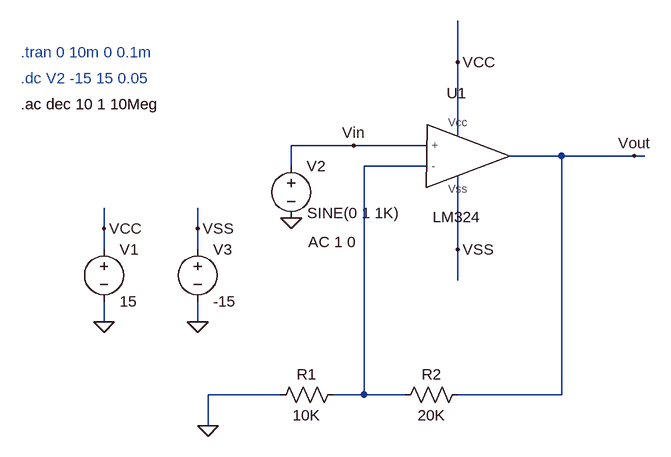
[diagram p0: schematic BAI 1 CHUAN BI & THUC HANH.asc]
BAI 1 CHUAN BI & THUC HANH.asc, the LTspice schematic file:
Version 4.1
SHEET 1 880 680
WIRE 512 -144 512 -208
WIRE 512 -32 512 -144
WIRE 352 -16 256 -16
WIRE 464 -16 352 -16
WIRE 672 0 592 0
WIRE 784 0 672 0
WIRE 800 0 784 0
WIRE 256 16 256 -16
WIRE 464 16 368 16
WIRE -32 112 -32 80
WIRE 112 112 112 80
WIRE -32 144 -32 112
WIRE 112 144 112 112
WIRE 512 144 512 32
WIRE 512 192 512 144
WIRE -32 256 -32 224
WIRE 112 256 112 224
WIRE 240 368 128 368
WIRE 368 368 368 16
WIRE 368 368 320 368
WIRE 432 368 368 368
WIRE 672 368 672 0
WIRE 672 368 512 368
WIRE 128 416 128 368
FLAG -32 256 0
FLAG -32 112 VCC
FLAG 112 256 0
FLAG 112 112 VSS
FLAG 512 -144 VCC
FLAG 512 144 VSS
FLAG 784 0 Vout
FLAG 128 416 0
FLAG 352 -16 Vin
FLAG 256 96 0
SYMBOL voltage -32 128 R0
SYMATTR InstName V1
SYMATTR Value 15
SYMBOL voltage 112 128 R0
SYMATTR InstName V3
SYMATTR Value -15
SYMBOL LM324 512 0 R0
SYMATTR InstName U1
SYMBOL res 528 352 R90
WINDOW 0 0 56 VBottom 2
WINDOW 3 32 56 VTop 2
SYMATTR InstName R2
SYMATTR Value 20K
SYMBOL res 336 352 R90
WINDOW 0 0 56 VBottom 2
WINDOW 3 32 56 VTop 2
SYMATTR InstName R1
SYMATTR Value 10K
SYMBOL voltage 256 0 R0
WINDOW 3 25 88 Left 2
WINDOW 123 26 133 Left 2
WINDOW 39 0 0 Left 0
SYMATTR Value SINE(0 1 1K)
SYMATTR Value2 AC 1 0
SYMATTR InstName V2
TEXT -160 -160 Left 2 ;.tran 0 10m 0 0.1m
TEXT -160 -120 Left 2 ;.dc V2 -15 15 0.05
TEXT -160 -80 Left 2 !.ac dec 10 1 10Meg

The netlist it stands for:
* BAI 1 CHUAN BI & THUC HANH.asc
V1 VCC 0 15
V3 VSS 0 -15
X§U1 Vin N001 VCC VSS Vout LM324  ; pins + - Vcc Vss ?
R2 Vout N001 20K
R1 N001 0 10K
V2 Vin 0 SINE(0 1 1K) AC 1 0
* .tran 0 10m 0 0.1m
* .dc V2 -15 15 0.05
.ac dec 10 1 10Meg
.lib E:\ThiThucHanhCoHa\CoHa\LM324.cir
.backanno
.end